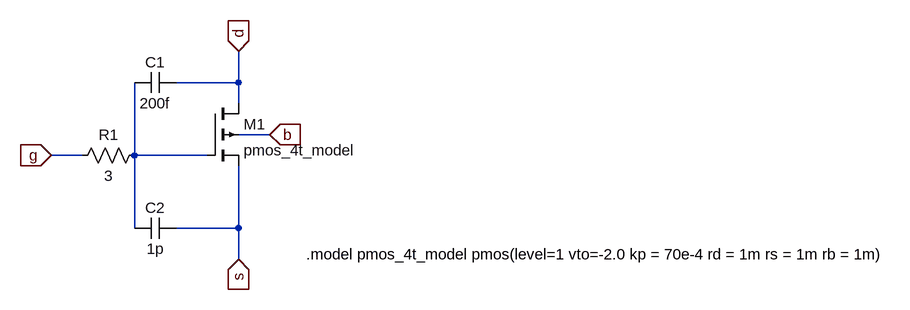
[diagram p0: schematic pmos_4t.asc]
pmos_4t.asc, the LTspice schematic file:
Version 4
SHEET 1 880 680
WIRE -288 -224 -288 -272
WIRE -288 -224 -384 -224
WIRE -288 -192 -288 -224
WIRE -240 -144 -288 -144
WIRE -528 -112 -576 -112
WIRE -448 -112 -448 -224
WIRE -336 -112 -448 -112
WIRE -448 0 -448 -112
WIRE -288 0 -288 -96
WIRE -288 0 -384 0
WIRE -288 48 -288 0
FLAG -576 -112 g
IOPIN -576 -112 In
FLAG -288 -272 d
IOPIN -288 -272 In
FLAG -288 48 s
IOPIN -288 48 In
FLAG -240 -144 b
IOPIN -240 -144 In
SYMBOL cap -384 -240 R90
WINDOW 0 0 32 VBottom 2
WINDOW 3 32 32 VTop 2
SYMATTR InstName C1
SYMATTR Value 200f
SYMBOL cap -384 -16 R90
WINDOW 0 0 32 VBottom 2
WINDOW 3 32 32 VTop 2
SYMATTR InstName C2
SYMATTR Value 1p
SYMBOL res -432 -128 R90
WINDOW 0 0 56 VBottom 2
WINDOW 3 32 56 VTop 2
SYMATTR InstName R1
SYMATTR Value 3
SYMBOL pmos4 -336 -192 R0
SYMATTR InstName M1
SYMATTR Value pmos_4t_model
TEXT -184 40 Left 2 !.model pmos_4t_model pmos(level=1 vto=-2.0 kp = 70e-4 rd = 1m rs = 1m rb = 1m)

The netlist it stands for:
* pmos_4t.asc
C1 d N001 200f
C2 s N001 1p
R1 N001 g 3
M1 d N001 s b pmos_4t_model
.model NMOS NMOS
.model PMOS PMOS
.lib standard.mos
.model pmos_4t_model pmos(level=1 vto=-2.0 kp = 70e-4 rd = 1m rs = 1m rb = 1m)
.backanno
.end